# EAGLE design das_updated_v7 (EAGLE 7.7.0)
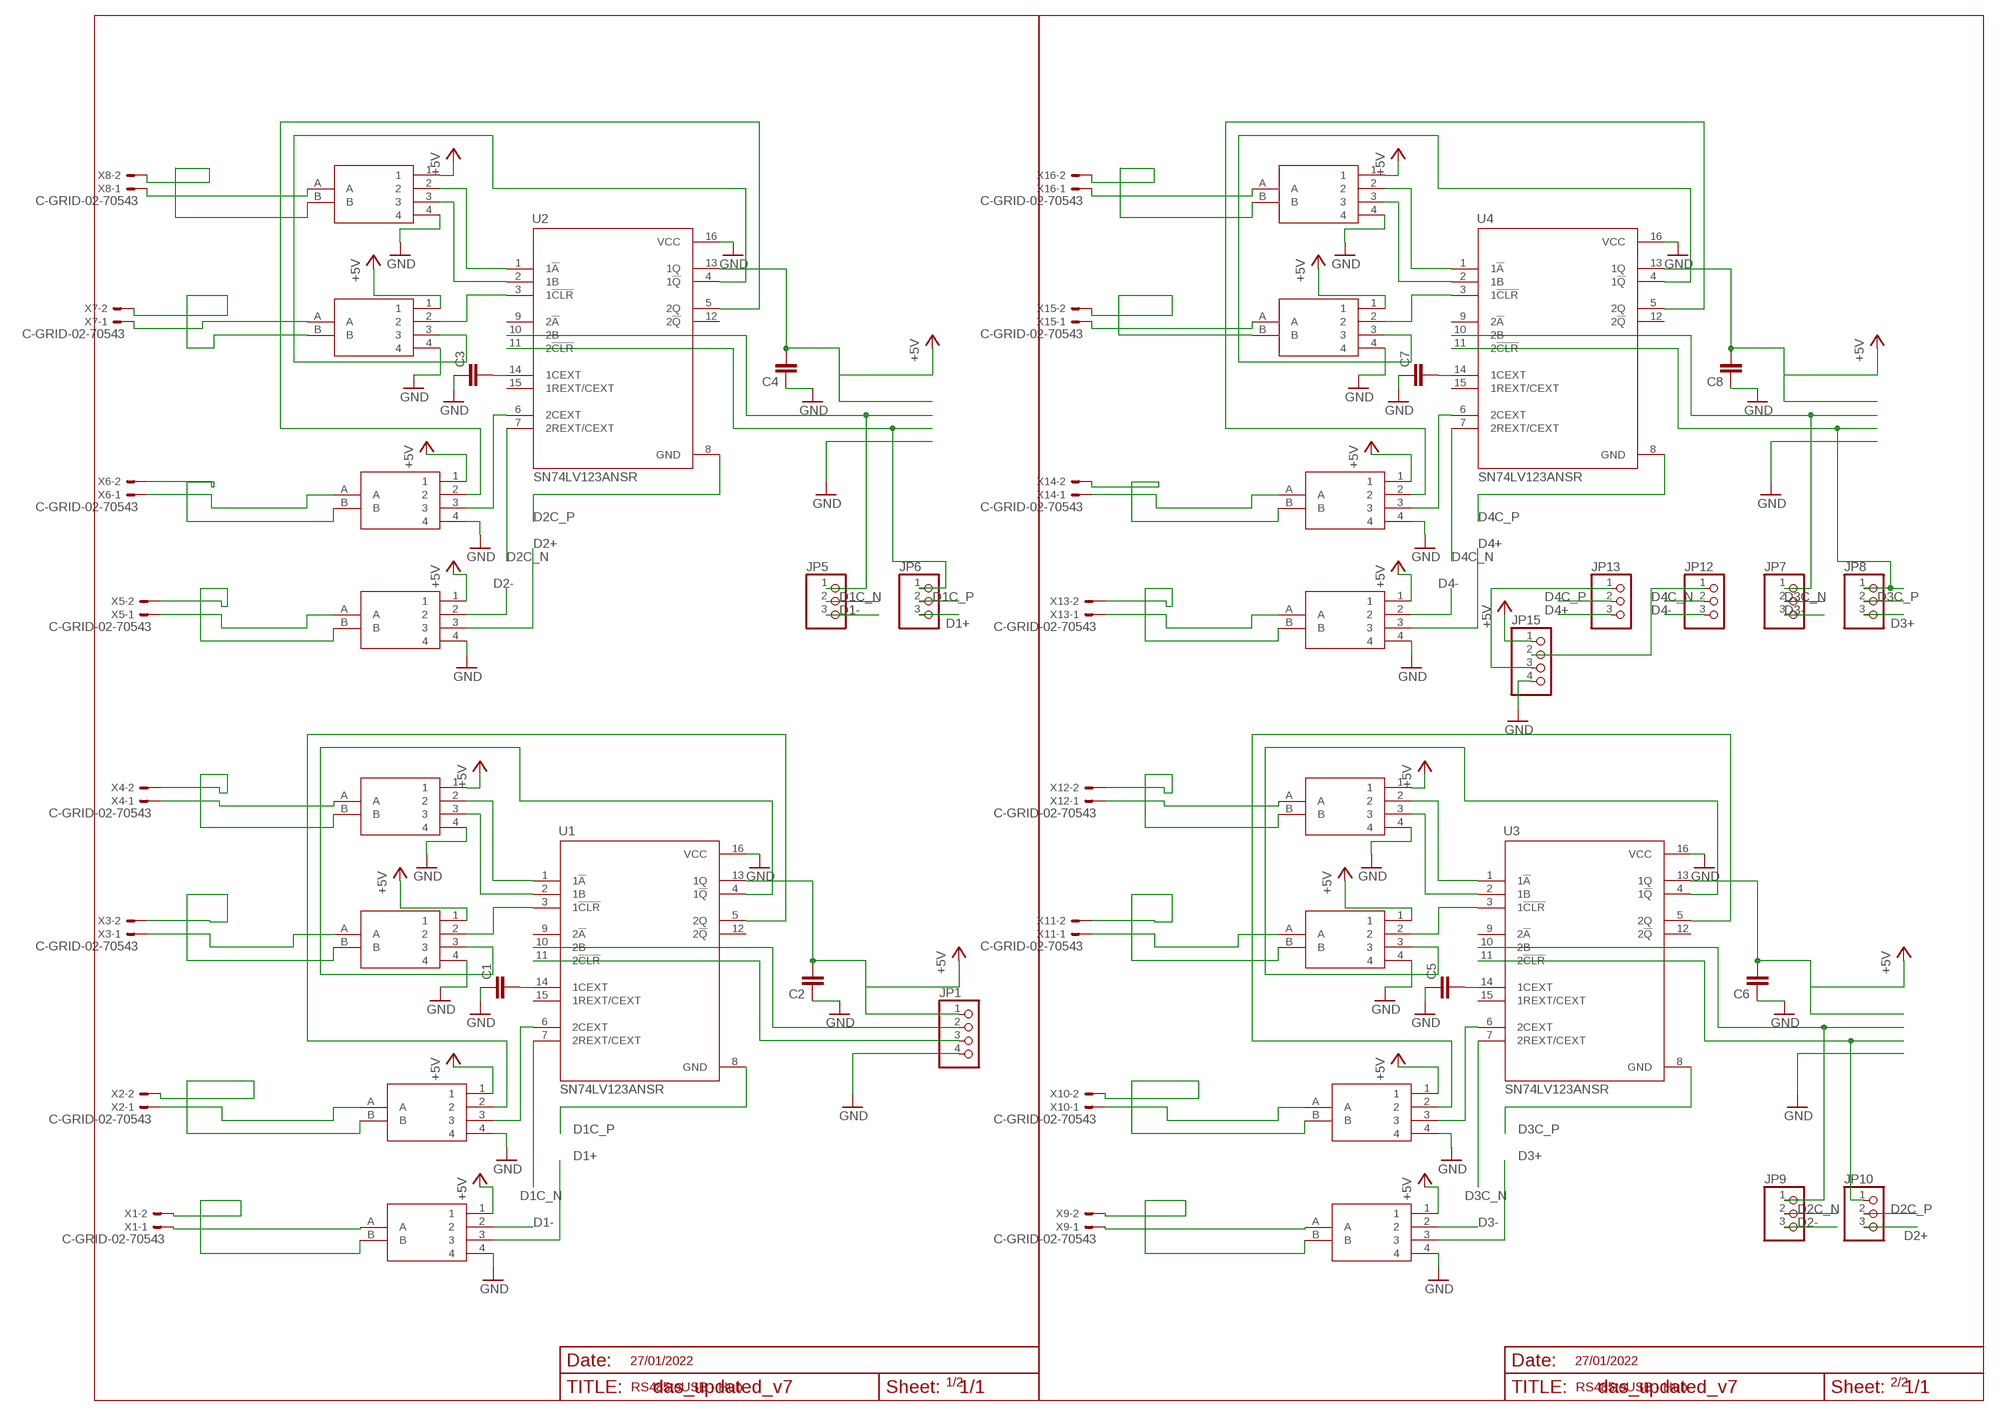
[diagram p0: schematic, sheet 1]

## Parts
C1  C-EUC0603K  [C0603K]
C2  C-EUC0603K  [C0603K]
C3  C-EUC0603K  [C0603K]
C4  C-EUC0603K  [C0603K]
C5  C-EUC0603K  [C0603K]
C6  C-EUC0603K  [C0603K]
C7  C-EUC0603K  [C0603K]
C8  C-EUC0603K  [C0603K]
JP1  PINHD-1X4  [1X04]
JP5  PINHD-1X3  [1X03]
JP6  PINHD-1X3  [1X03]
JP7  PINHD-1X3  [1X03]
JP8  PINHD-1X3  [1X03]
JP9  PINHD-1X3  [1X03]
JP10  PINHD-1X3  [1X03]
JP12  PINHD-1X3  [1X03]
JP13  PINHD-1X3  [1X03]
JP15  PINHD-1X4  [1X04]
U1  SN74LV123ANSR  [SOIC127P780X200-16N]
U2  SN74LV123ANSR  [SOIC127P780X200-16N]
U3  SN74LV123ANSR  [SOIC127P780X200-16N]
U4  SN74LV123ANSR  [SOIC127P780X200-16N]
USB2RS1  USB2RS485  [USB2RS485]
USB2RS2  USB2RS485  [USB2RS485]
USB2RS3  USB2RS485  [USB2RS485]
USB2RS4  USB2RS485  [USB2RS485]
USB2RS5  USB2RS485  [USB2RS485]
USB2RS6  USB2RS485  [USB2RS485]
USB2RS7  USB2RS485  [USB2RS485]
USB2RS8  USB2RS485  [USB2RS485]
USB2RS9  USB2RS485  [USB2RS485]
USB2RS10  USB2RS485  [USB2RS485]
USB2RS11  USB2RS485  [USB2RS485]
USB2RS12  USB2RS485  [USB2RS485]
USB2RS13  USB2RS485  [USB2RS485]
USB2RS14  USB2RS485  [USB2RS485]
USB2RS15  USB2RS485  [USB2RS485]
USB2RS16  USB2RS485  [USB2RS485]
X1  C-GRID-02-70543  [70543-02]
X2  C-GRID-02-70543  [70543-02]
X3  C-GRID-02-70543  [70543-02]
X4  C-GRID-02-70543  [70543-02]
X5  C-GRID-02-70543  [70543-02]
X6  C-GRID-02-70543  [70543-02]
X7  C-GRID-02-70543  [70543-02]
X8  C-GRID-02-70543  [70543-02]
X9  C-GRID-02-70543  [70543-02]
X10  C-GRID-02-70543  [70543-02]
X11  C-GRID-02-70543  [70543-02]
X12  C-GRID-02-70543  [70543-02]
X13  C-GRID-02-70543  [70543-02]
X14  C-GRID-02-70543  [70543-02]
X15  C-GRID-02-70543  [70543-02]
X16  C-GRID-02-70543  [70543-02]

## Nets
+5V: C2.2 C4.2 C6.2 C8.2 JP1.1 JP15.1 U1.13(1Q) U2.13(1Q) U3.13(1Q) U4.13(1Q) USB2RS1.1 USB2RS2.1 USB2RS3.1 USB2RS4.1 USB2RS5.1 USB2RS6.1 USB2RS7.1 USB2RS8.1 USB2RS9.1 USB2RS10.1 USB2RS11.1 USB2RS12.1 USB2RS13.1 USB2RS14.1 USB2RS15.1 USB2RS16.1
D1+ [data]: JP6.3 USB2RS4.3
D1- [data]: JP5.3 USB2RS4.2
D1C_N [data]: JP5.2 U1.7(2REXT/CEXT)
D1C_P [data]: JP6.2 U1.8(GND)
D2+ [data]: JP10.3 USB2RS8.3
D2- [data]: JP9.3 USB2RS8.2
D2C_N [data]: JP9.2 U2.7(2REXT/CEXT)
D2C_P [data]: JP10.2 U2.8(GND)
D3+ [data]: JP8.3 USB2RS12.3
D3- [data]: JP7.3 USB2RS12.2
D3C_N [data]: JP7.2 U3.7(2REXT/CEXT)
D3C_P [data]: JP8.2 U3.8(GND)
D4+ [data]: JP13.3 USB2RS16.3
D4- [data]: JP12.3 USB2RS16.2
D4C_N [data]: JP12.2 U4.7(2REXT/CEXT)
D4C_P [data]: JP13.2 U4.8(GND)
D_N [data]: JP1.3 U1.11(2!CLR)
D_P [data]: JP1.2 U1.10(2B)
GND: C1.1 C2.1 C3.1 C4.1 C5.1 C6.1 C7.1 C8.1 JP1.4 JP15.4 U1.16(VCC) U2.16(VCC) U3.16(VCC) U4.16(VCC) USB2RS1.4 USB2RS2.4 USB2RS3.4 USB2RS4.4 USB2RS5.4 USB2RS6.4 USB2RS7.4 USB2RS8.4 USB2RS9.4 USB2RS10.4 USB2RS11.4 USB2RS12.4 USB2RS13.4 USB2RS14.4 USB2RS15.4 USB2RS16.4
MOD2_N [data]: U1.6(2CEXT) USB2RS3.3
MOD2_P [data]: U1.5(2Q) USB2RS3.2
MOD3_N [data]: U1.4(1!Q) USB2RS2.3
MOD3_P [data]: U1.3(1!CLR) USB2RS2.2
MOD4_N [data]: U1.2(1B) USB2RS1.3
MOD4_P [data]: U1.1(1!A) USB2RS1.2
MOD7_N [data]: U2.6(2CEXT) USB2RS7.3
MOD7_P [data]: U2.5(2Q) USB2RS7.2
MOD8_N [data]: U2.4(1!Q) USB2RS6.3
MOD8_P [data]: U2.3(1!CLR) USB2RS6.2
MOD9_N [data]: U2.2(1B) USB2RS5.3
MOD9_P [data]: U2.1(1!A) USB2RS5.2
MOD10_N [data]: U3.6(2CEXT) USB2RS11.3
MOD10_P [data]: U3.5(2Q) USB2RS11.2
MOD11_N [data]: U3.4(1!Q) USB2RS10.3
MOD11_P [data]: U3.3(1!CLR) USB2RS10.2
MOD12_N [data]: U3.2(1B) USB2RS9.3
MOD12_P [data]: U3.1(1!A) USB2RS9.2
MOD14_N [data]: U4.6(2CEXT) USB2RS15.3
MOD14_P [data]: U4.5(2Q) USB2RS15.2
MOD15_N [data]: U4.4(1!Q) USB2RS14.3
MOD15_P [data]: U4.3(1!CLR) USB2RS14.2
MOD16_N [data]: U4.2(1B) USB2RS13.3
MOD16_P [data]: U4.1(1!A) USB2RS13.2
N$3: JP6.1 U2.11(2!CLR)
N$7: C1.2 U1.14(1CEXT)
N$17: C3.2 U2.14(1CEXT)
N$21: JP5.1 U2.10(2B)
N$31: JP12.1 JP15.2
N$32: JP13.1 JP15.3
N$42: C5.2 U3.14(1CEXT)
N$58: C7.2 U4.14(1CEXT)
N$59: JP7.1 U4.10(2B)
N$78: JP8.1 U4.11(2!CLR)
N$79: JP9.1 U3.10(2B)
N$80: JP10.1 U3.11(2!CLR)
X1_N [data]: USB2RS4.B X1.2
X1_P [data]: USB2RS4.A X1.1
X2_N [data]: USB2RS3.B X2.2
X2_P [data]: USB2RS3.A X2.1
X3_N [data]: USB2RS2.B X3.2
X3_P [data]: USB2RS2.A X3.1
X4_N [data]: USB2RS1.B X4.2
X4_P [data]: USB2RS1.A X4.1
X5_N [data]: USB2RS8.B X5.2
X5_P [data]: USB2RS8.A X5.1
X6_N [data]: USB2RS7.B X6.2
X6_P [data]: USB2RS7.A X6.1
X7_N [data]: USB2RS6.B X7.2
X7_P [data]: USB2RS6.A X7.1
X8_N [data]: USB2RS5.B X8.2
X8_P [data]: USB2RS5.A X8.1
X9_N [data]: USB2RS12.B X9.2
X9_P [data]: USB2RS12.A X9.1
X10_N [data]: USB2RS11.B X10.2
X10_P [data]: USB2RS11.A X10.1
X11_N [data]: USB2RS10.B X11.2
X11_P [data]: USB2RS10.A X11.1
X12_N [data]: USB2RS9.B X12.2
X12_P [data]: USB2RS9.A X12.1
X13_N [data]: USB2RS16.B X13.2
X13_P [data]: USB2RS16.A X13.1
X14_N [data]: USB2RS15.B X14.2
X14_P [data]: USB2RS15.A X14.1
X15_N [data]: USB2RS14.B X15.2
X15_P [data]: USB2RS14.A X15.1
X16_N [data]: USB2RS13.B X16.2
X16_P [data]: USB2RS13.A X16.1
Unconnected: U1.9(2!A) U1.12(2!Q) U1.15(1REXT/CEXT) U2.9(2!A) U2.12(2!Q) U2.15(1REXT/CEXT) U3.9(2!A) U3.12(2!Q) U3.15(1REXT/CEXT) U4.9(2!A) U4.12(2!Q) U4.15(1REXT/CEXT)

## Notes on the sheet
- 27/01/2022 | 27/01/2022
- 1/2 | 2/2
- RS485toUSB - Hub | RS485toUSB - Hub

## Library data of the parts
C1-C8 = resistor:C-EU: CAPACITOR, European symbol
JP1 JP15 = pinhead:PINHD-1X4: PIN HEADER
JP5-JP10 JP12 JP13 = pinhead:PINHD-1X3: PIN HEADER
U1-U4 = SN74LV123ANSR:SN74LV123ANSR: Monostable Multivibrator 13ns 16-SO Check prices <https://pricing.snapeda.com/parts/SN74LV123ANSR/Texas%20Instruments/view-part?ref=eda>; AVAILABILITY: In Stock; DESCRIPTION: Dual Retriggerable Monostable Multivibrators 16-SO -40 to 125; MF: Texas Instruments; MP: SN74LV123ANSR; PACKAGE: SOP-16 Texas Instruments; PRICE: None; PURCHASE-URL: https://pricing.snapeda.com/search/part/SN74LV123ANSR/?ref=eda
USB2RS1-USB2RS16 = USB2RS485:USB2RS485
X1-X16 = con-molex:C-GRID-02: CONNECTOR wire to board 2.54 mm (0.100") pitch header; MF: MOLEX; OC_FARNELL: unknown; OC_NEWARK: unknown

## Net classes
0 default: clearance 0.305 mm
1 data: width 0.127 mm, clearance 0.305 mm

## Board
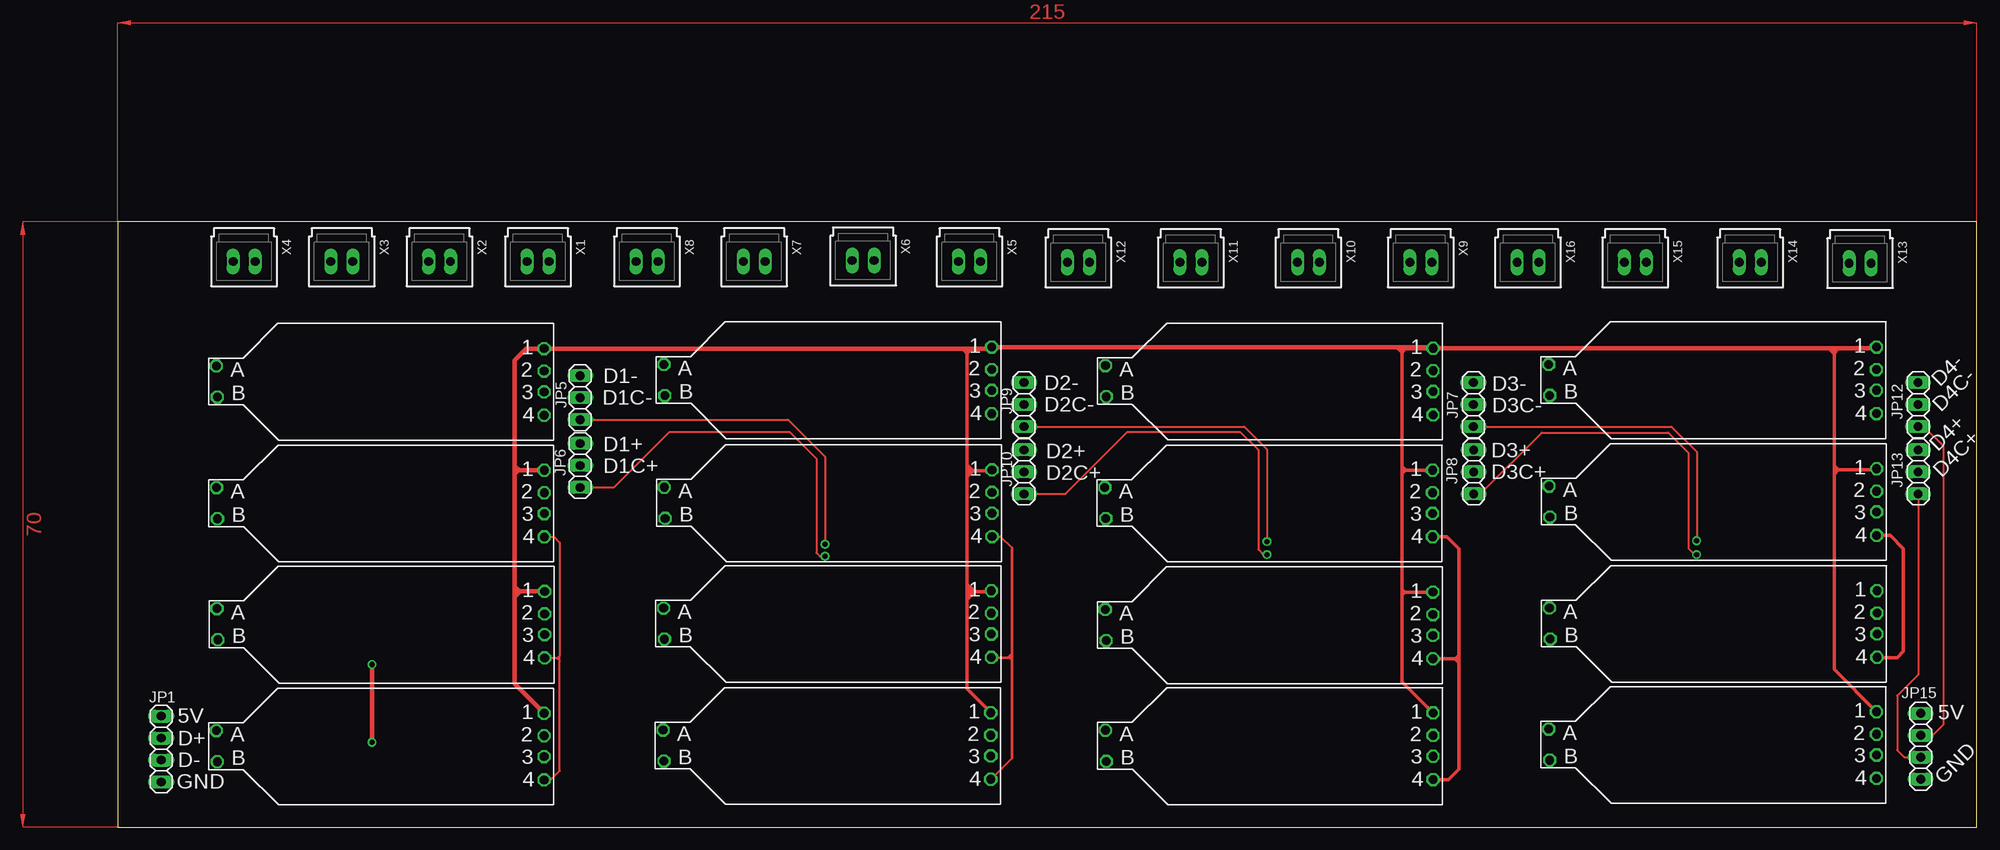
[diagram p1: board, top side]
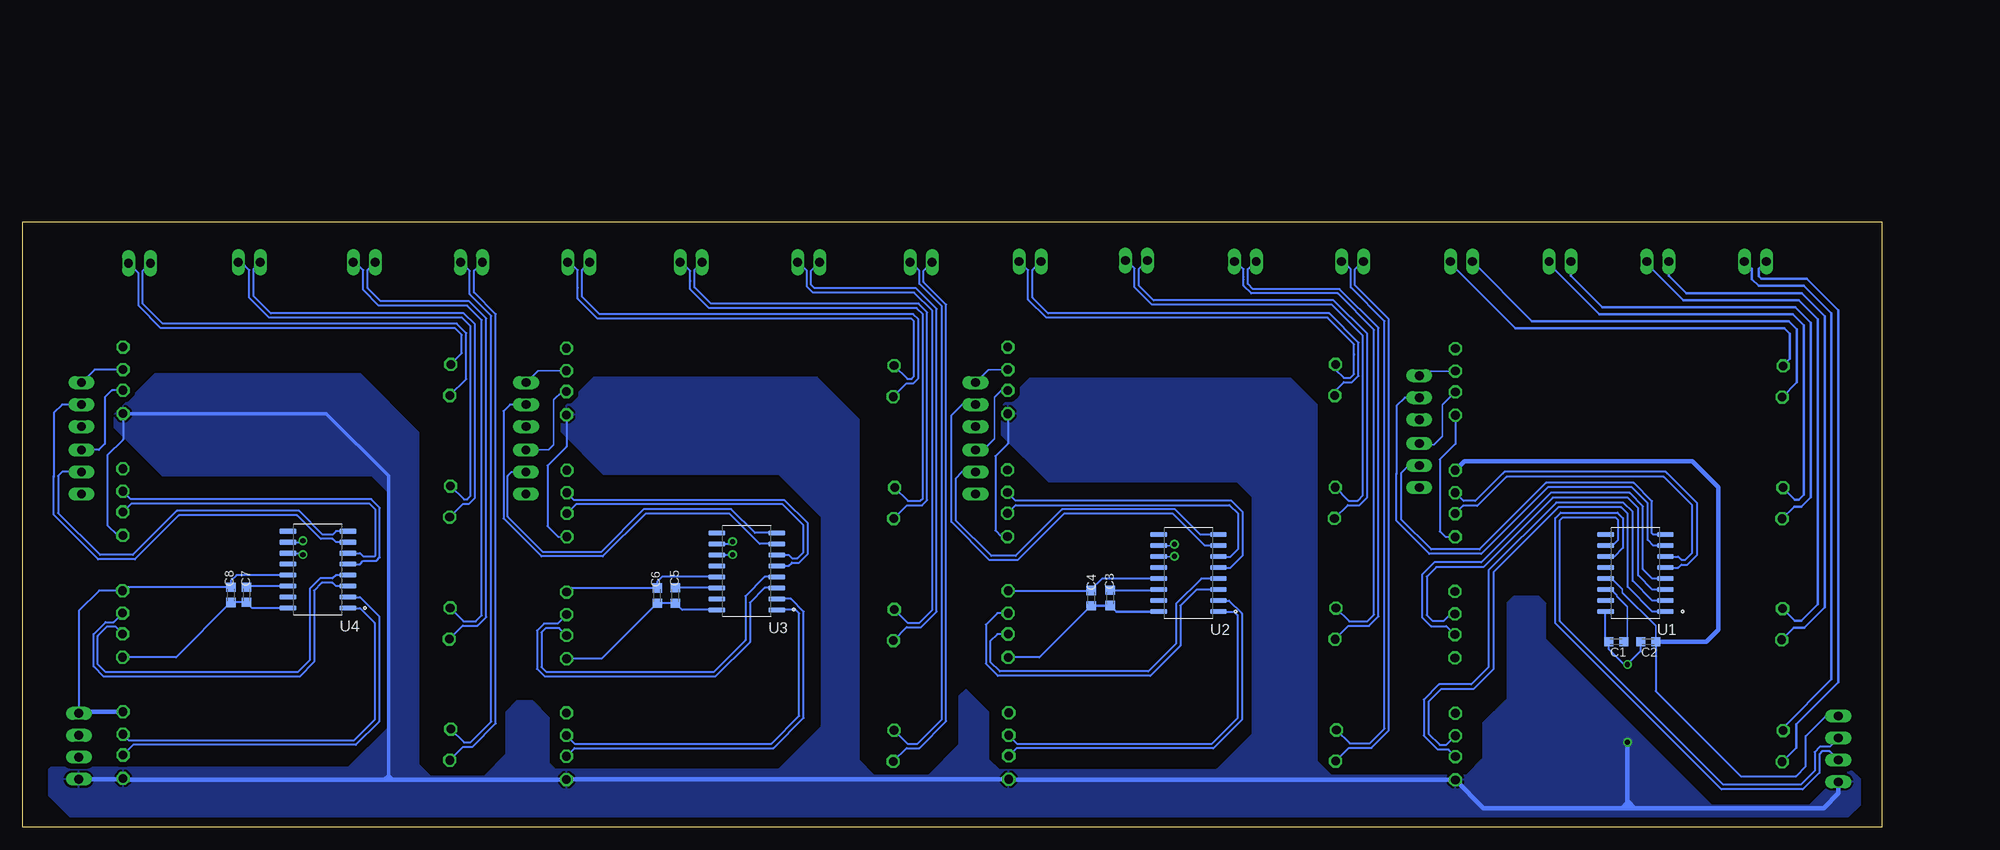
[diagram p2: board, bottom side, seen from below]

Size 215 x 70 mm. Coordinates in mm from the lower left corner, seen from the top.
Outline: 0,0 215,0 215,70 0,70 0,0
Copper layers (1*16): Top 0.035mm / dielectric 1.5mm / Bottom 0.035mm
Design rules "default": minimum track width 6mil, minimum drill 0.35mm, track to track 6mil, track to pad 6mil, pad to pad 6mil, via to via 6mil, smd to smd 6mil, copper to edge 40mil, drill to drill 6mil, minimum pad ring 10mil, minimum via ring 8mil, stop-mask expansion 4mil, vias tented up to drill 0mil, thermal gap 10mil

### Footprints (pad centres in the part's own frame; a part is rotated, then mirrored left to right if it is on the bottom)
C0603K = smd 1.05 x 1.08: 1 -0.875,0; 2 0.875,0
1X04 = drill 1.016 long: 1 -3.81,0; 2 -1.27,0; 3 1.27,0; 4 3.81,0
1X03 = drill 1.016 long: 1 -2.54,0; 2 0,0; 3 2.54,0
SOIC127P780X200-16N = smd 1.97 x 0.61: 1 -3.465,4.445; 2 -3.465,3.175; 3 -3.465,1.905; 4 -3.465,0.635; 5 -3.465,-0.635; 6 -3.465,-1.905; 7 -3.465,-3.175; 8 -3.465,-4.445; 9 3.465,-4.445; 10 3.465,-3.175; 11 3.465,-1.905; 12 3.465,-0.635; 13 3.465,0.635; 14 3.465,1.905; 15 3.465,3.175; 16 3.465,4.445
USB2RS485 = drill 1 pad 1.422 octagon: 1 36.9,3.6; 2 36.9,1; 3 36.9,-1.4; 4 36.9,-4.1; A -1,1.6; B -0.9,-2
70543-02 = drill 1.016 long: 1 -1.27,0; 2 1.27,0

### Placement (x,y rotation side)
C1  30.69,21.42 0 bottom
C2  27,21.42 0 bottom
C3  89.22,26.49 90 bottom
C4  91.42,26.48 90 bottom
C5  139.52,26.77 90 bottom
C6  141.62,26.76 90 bottom
C7  189.12,26.85 90 bottom
C8  190.92,26.84 90 bottom
JP1  5.02,9.02 270 top
JP5  53.48,49.65 90 top
JP6  53.48,41.81 90 top
JP7  156.78,48.85 90 top
JP8  156.81,41.06 90 top
JP9  104.81,48.85 90 top
JP10  104.81,41.06 90 top
JP12  208.21,48.85 90 top
JP13  208.21,41.06 90 top
JP15  208.51,9.34 270 top
U1  28.48,29.36 180 bottom
U2  80.17,29.36 180 bottom
U3  131.26,29.56 180 bottom
U4  180.85,29.76 180 bottom
USB2RS1  12.4,9.55 0 top
USB2RS2  12.46,23.65 0 top
USB2RS3  12.42,37.65 0 top
USB2RS4  12.4,51.72 0 top
USB2RS5  64.06,9.62 0 top
USB2RS6  64.12,23.72 0 top
USB2RS7  64.2,37.69 0 top
USB2RS8  64.16,51.89 0 top
USB2RS9  115.22,9.59 0 top
USB2RS10  115.2,23.56 0 top
USB2RS11  115.16,37.66 0 top
USB2RS12  115.22,51.76 0 top
USB2RS13  166.5,9.73 0 top
USB2RS14  166.56,23.73 0 top
USB2RS15  166.52,37.83 0 top
USB2RS16  166.5,51.9 0 top
X1  48.6,65.4 180 top
X2  37.2,65.4 180 top
X3  25.9,65.4 180 top
X4  14.6,65.4 180 top
X5  98.5,65.4 180 top
X6  86.2,65.5 180 top
X7  73.6,65.4 180 top
X8  61.2,65.4 180 top
X9  150.7,65.3 180 top
X10  137.7,65.3 180 top
X11  124.1,65.3 180 top
X12  111.1,65.3 180 top
X13  201.5,65.2 180 top
X14  188.8,65.3 180 top
X15  175.5,65.3 180 top
X16  163.1,65.3 180 top

### Tracks (layer width: path | path; a pad name or v marks a point on that pad's centre or on a via)
+5V
  Top 0.254: 201.4,55.36 201.4,55.06 201.3,55.06 | USB2RS3.1 46.62,41.25 45.9,41.97 | 45.9,41.97 45.9,54 46,54.1 | 45.9,41.1 45.9,41.97 | 148.5,55.3 148.5,55.49
  Top 0.406: 98.2,55.32 98.2,54.8 | 98.2,54.8 98.2,41.9 | 98.2,41.9 98.9,41.2 | 98.9,41.2 101.01,41.2 USB2RS7.1 | 98.2,41.9 98.2,41.2 | 98.2,41.2 98.2,40.6 | 98.2,40.6 98.2,28.1 | 98.2,28.1 98.65,27.65 | 98.65,27.65 99.1,27.2 | 99.1,27.2 100.9,27.2 USB2RS6.1 | USB2RS5.1 98.2,15.98 98.2,26.3 | 98.2,26.3 98.2,27.2 | 98.2,27.2 98.2,28.1 | 99.1,27.2 98.65,26.75 | 98.65,26.75 98.2,26.3 | 99.1,27.2 98.2,27.2 | 98.65,27.65 98.2,27.2 | 98.2,27.2 98.65,26.75 | 98.9,41.2 98.3,40.6 98.2,40.6 | 98.9,41.2 98.2,41.2 | 98.2,54.8 97.68,55.32 97.6,55.32 | 98.2,54.8 98.7,55.3 98.7,55.32 | 46.4,41.25 45.9,40.75 45.9,40.3 | 45.9,27.9 46.55,27.25 46.65,27.25 | 45.9,26.5 46.65,27.25 | 46.65,27.25 46.7,27.25 | USB2RS11.1 148.9,41.26 | 148.9,41.26 148.74,41.26 148.5,41.5 | 148.5,41.5 148.5,41.7 | 148.5,41.7 148.5,54.86 | 148.5,54.89 148.5,55.3 | USB2RS10.1 148.84,27.16 | 148.84,27.16 148.5,27.5 | 148.5,27.5 148.5,40.86 | 148.5,40.86 148.5,41.5 | 148.5,40.86 148.9,41.26 | 148.9,41.26 148.9,41.3 148.5,41.7 | USB2RS9.1 148.5,16.81 148.5,26.82 | 148.5,26.82 148.5,27.5 | 148.5,26.82 148.84,27.16 | 148.5,54.86 148.5,54.89 | 148.5,54.89 147.9,55.49 | 148.5,54.86 149,55.36 | USB2RS13.1 198.5,18.23 198.5,40.8 | 198.5,40.8 198.5,41.3 | 198.5,41.3 198.5,41.8 | 198.5,41.8 198.5,54.8 | 198.5,55.36 198.5,54.8 | 198.5,54.8 199.06,55.36 199.1,55.36 | 198.5,54.8 198.46,54.8 197.9,55.36 | USB2RS15.1 203.29,41.3 199,41.3 | 199,41.3 198.5,41.3 | 199,41.3 198.5,41.8 | 199,41.3 198.5,40.8
  Top 0.508: 46,54.1 47.2,55.3 49.28,55.3 USB2RS4.1 97.6,55.32 98.2,55.32 98.7,55.32 100.89,55.32 USB2RS8.1 147.9,55.49 152.27,55.49 152.4,55.36 | USB2RS1.1 45.9,16.55 45.9,26.5 45.9,27.1 | 45.9,27.1 45.9,27.9 45.9,40.3 45.9,41.1 | 45.9,41.1 45.9,54 | USB2RS3.1 46.4,41.25 46.05,41.25 45.9,41.1 | USB2RS2.1 46.7,27.25 46.05,27.25 45.9,27.1 | USB2RS16.1 203.26,55.36 201.4,55.36 199.1,55.36 198.5,55.36 197.9,55.36 152.4,55.36 | 152.4,55.36 USB2RS12.1 149,55.36 148.56,55.36 148.5,55.3
  Bottom 0.2: U1.13 31.23,28.73 29.98,27.48 29.98,27.11 26.14,23.27 26.14,21.43 C2.2
  Bottom 0.254: 134.01,28.94 U3.13 141.07,28.92 141.62,28.38 C6.2 151.62,27.63 USB2RS10.1 | 184.29,29.1 U4.13 190.28,29.12 190.92,28.48 C8.2 203.07,27.72 USB2RS14.1 206.17,27.33 208.5,25 JP15.1 | USB2RS6.1 101,27.3 91.47,27.3 C4.2 91.48,27.42 90.17,28.73 U2.13 | C2.2 26.12,15.73 16.3,5.9 9.9,5.9 8.8,7 8.8,10.5 6.47,12.83 JP1.1
  Bottom 0.508: JP15.1 208.33,13.33 USB2RS13.1 | USB2RS3.1 48.27,42.3 21.9,42.3 18.9,39.3 18.9,22.8 20.27,21.43 26.14,21.43
D1+
  Bottom 0.2: USB2RS4.3 50.8,48.82 50.8,45.2 51.8,44.2 53.33,44.2 JP6.3
D1-
  Bottom 0.2: USB2RS4.2 52.95,52.72 JP5.3
D1C_N
  Bottom 0.203: U1.7 26.41,32.53 27.07,33.2 27.07,37.47 28.9,39.3 38.6,39.3 46.31,31.59 52.31,31.59 56.11,35.39 56.11,40.8 56.11,40.9 56.11,48.69 55.15,49.65 JP5.2
D1C_P
  Bottom 0.203: U1.8 26.41,33.8 26.56,33.96 26.56,37.68 28.69,39.81 38.81,39.81 46.52,32.1 52.1,32.1 55.6,35.6 55.6,40.9 54.69,41.81 JP6.2
D2+
  Bottom 0.2: JP10.3 103.9,43.6 102.6,44.9 102.6,49.7 101.81,50.49 USB2RS8.3
D2-
  Bottom 0.2: USB2RS8.2 103.31,52.89 JP9.3
D2C_N
  Bottom 0.203: U2.7 78.25,32.53 81.94,36.22 94.58,36.22 99.95,30.85 103.17,30.85 107.61,35.29 107.61,47.59 106.35,48.85 JP9.2
D2C_P
  Bottom 0.203: U2.8 78.81,33.8 81.73,36.73 94.79,36.73 100.16,31.36 102.96,31.36 107.1,35.5 107.1,40.3 106.34,41.06 JP10.2
D3+
  Bottom 0.2: USB2RS12.3 152.62,50.36 153.6,49.38 153.6,44.2 154.2,43.6 JP8.3
D3-
  Bottom 0.2: USB2RS12.2 155.41,52.76 JP7.3
D3C_N
  Bottom 0.203: U3.7 129.75,32.73 133.26,36.24 142.96,36.24 147.91,31.29 155.01,31.29 159.41,35.69 159.41,48.09 158.65,48.85 JP7.2
D3C_P
  Bottom 0.203: U3.8 130.31,34 133.05,36.75 143.17,36.75 148.12,31.8 154.8,31.8 158.9,35.9 158.9,40.6 158.44,41.06 JP8.2
D4+
  Bottom 0.254: USB2RS16.3 204.7,50.5 205.5,49.7 205.5,44.3 206.2,43.6 JP13.3
D4-
  Bottom 0.254: USB2RS16.2 206.7,52.9 JP12.3
D4C_N
  Bottom 0.203: U4.7 178.78,32.94 179.16,33.32 180.53,33.32 183.26,36.04 196.96,36.04 202.05,30.95 206.27,30.95 211.41,36.09 211.41,40.5 211.41,40.6 211.41,47.89 210.45,48.85 JP12.2
D4C_P
  Bottom 0.203: U4.8 178.78,34.2 179.16,33.82 180.32,33.82 183.05,36.55 197.17,36.55 202.26,31.46 206.06,31.46 210.9,36.3 210.9,40.6 210.44,41.06 JP13.2
D_N
  Bottom 0.254: JP1.3 6.01,8.74 6.9,8.74 7.2,8.44 7.2,6.27 9.13,4.34 18.53,4.34 37.76,23.57 37.76,35.73 37.13,36.36 30.57,36.36 29.92,35.71 29.92,32.28 30.93,31.27 U1.11
D_P
  Bottom 0.254: JP1.2 6.01,9.3 7.13,9.3 7.76,8.67 7.76,6.5 9.36,4.9 18.3,4.9 37.2,23.8 37.2,35.5 36.9,35.8 30.8,35.8 30.48,35.48 30.48,33.22 31.16,32.53 U1.10
GND  (via drill 0.6)
  Top 0.254: USB2RS3.4 50.45,33.55 51.1,32.9 51.1,19.8 | 51.1,19.8 50.8,19.5 | 50.8,19.5 49.41,19.5 USB2RS2.4 | USB2RS1.4 50.05,5.45 51.1,6.5 51.1,19.2 | 51.1,19.2 51.1,19.8 | 50.8,19.5 51.1,19.2
  Top 0.305: USB2RS7.4 102.11,33.59 103.4,32.3 103.4,20.1 | 103.4,20.1 102.9,19.6 | 102.9,19.6 101.04,19.6 USB2RS6.4 | USB2RS5.4 103.4,7.96 103.4,19.3 | 103.4,19.3 103.4,19.7 | 103.4,19.7 103.4,20.1 | 103.4,19.3 103.1,19.6 | 103.1,19.6 102.9,19.6 | 103.4,19.7 103.2,19.7 103.1,19.6
  Top 0.406: USB2RS11.4 153.74,33.56 155.1,32.2 155.1,19.86 | 155.1,19.86 155.1,19.5 | 155.1,19.5 155.1,19 | 155.1,19 155.1,6.7 153.89,5.49 USB2RS9.4 | USB2RS10.4 154.7,19.46 | 154.7,19.46 155.06,19.46 155.1,19.5 | 154.7,19.46 155.1,19.86 | 154.7,19.46 154.7,19.4 155.1,19 | USB2RS15.4 204.97,33.73 206.5,32.2 206.5,20.3 205.8,19.6 203.49,19.6 USB2RS14.4
  Top 0.508: v29.4,18.8 v29.4,9.8
  Bottom 0.254: 134.85,24.98 U3.16 138.74,25.12 C5.1 141.61,25.9 C6.1 | C6.1 141.6,25.91 | C7.1 189.13,25.97 | C3.1 89.2,25.59 | 152.08,47.7 USB2RS12.4 152.12,43.98 154.3,41.8 154.3,34.8 153.06,33.56 USB2RS11.4 | U4.16 188.46,25.31 C7.1 | C7.1 C8.1 197.25,19.63 USB2RS14.4 | USB2RS4.4 49.3,44.3 51.1,42.5 51.1,34.2 50.45,33.55 USB2RS3.4 | U1.16 31.95,21.8 C1.1 31.57,20.56 29.8,18.8 v29.4,18.8 27.9,20.3 27.9,21.4 C2.1 | C6.1 148.04,19.46 USB2RS10.4 | C4.1 91.56,25.46 97.41,19.62 USB2RS6.4 | USB2RS16.4 203.4,47.3 203.4,44.8 205.2,43 205.2,34.9 204.03,33.73 USB2RS15.4 | USB2RS8.4 101.06,44.34 102.5,42.9 102.5,34.3 101.79,33.59 USB2RS7.4
  Bottom 0.305: U2.16 88.52,24.91 C3.1 91.41,25.62 91.56,25.46
  Bottom 0.406: 172.7,5.49 172.7,6 | 172.7,6 172.7,40.6 179.9,47.8 202.9,47.8 203.4,47.3 | 172.2,5.49 172.2,5.5 172.7,6 | 172.7,6 173.2,5.5 173.2,5.49
  Bottom 0.508: JP1.4 5.02,3.88 6.7,2.2 28.6,2.2 | 28.6,2.2 29.3,2.2 | 29.3,2.2 30,2.2 | 30,2.2 46.05,2.2 USB2RS1.4 100.89,5.45 USB2RS5.4 152.09,5.52 USB2RS9.4 172.2,5.49 172.7,5.49 173.2,5.49 203.26,5.49 USB2RS13.4 203.5,5.53 JP15.4 | v29.4,9.8 29.4,2.8 | 29.3,2.2 29.3,2.9 | 29.3,2.9 28.6,2.2 | 29.3,2.9 29.4,2.8 | 29.4,2.8 30,2.2
  pour Bottom (isolate 0.61): 3.5,6.5 2.5,5.5 2.5,2.6 3.9,1.2 209.5,1.2 212,3.7 212,6.6 211.7,6.9 177.3,6.9 172.7,11.5 172.7,38.7 174.6,40.6 198.8,40.6 204.4,46.2 204.4,47.7 199.7,52.4 176,52.4 169.2,45.6 169.2,7.2 167.9,5.9 161.6,5.9 159.1,8.4 159.1,13.3 157.8,14.6 156.1,14.6 154.1,12.6 154.1,7.3 153.5,6.7 127.5,6.7 122.6,11.6 122.6,35.9 127.5,40.8 147.8,40.8 152.7,45.7 152.7,48.2 148.9,52 123.2,52 118.3,47.1 118.3,7.7 116.6,6 110.2,6 106.7,9.5 106.7,15.1 105.9,15.9 103.3,13.3 103.3,7.8 102.1,6.6 76.9,6.6 72.8,10.7 72.8,38.2 74.5,39.9 96.3,39.9 101.9,45.5 101.9,48.5 98.5,51.9 68.4,51.9 65.3,48.8 65.3,7.6 63.7,6 48,6 46.1,7.9 46.1,12 43.3,14.8 43.3,25.9 42.5,26.7 39.7,26.7 38.9,25.9 38.9,21.7 19.7,2.5 8.3,2.5 4.3,6.5
MOD2_N
  Bottom 0.254: U1.6 23.52,31.27 23.17,30.91 22.7,30.91 21.9,31.71 21.9,37.2 25.2,40.5 43.4,40.5 46.76,37.14 48.43,37.14 USB2RS3.3
MOD2_P
  Bottom 0.254: U1.5 23.52,29.99 23.17,30.35 22.47,30.35 21.34,31.48 21.34,37.43 24.8,40.89 | 24.8,40.89 | 24.8,40.89 24.97,41.06 43.63,41.06 43.8,40.89 | 43.8,40.89 | 43.8,40.89 46.99,37.7 48.37,37.7 USB2RS3.2
MOD3_N
  Bottom 0.254: U1.4 26.51,28.73 27.6,29.82 27.6,37.09 29.15,38.64 38.27,38.64 46.31,30.6 51.73,30.6 53.16,29.17 53.16,24.27 52.13,23.24 50.35,23.24 USB2RS2.3
MOD3_P
  Bottom 0.254: U1.3 26.51,27.45 28.16,29.11 28.16,36.86 29.38,38.08 38.04,38.08 46.08,30.04 51.5,30.04 52.6,28.94 52.6,24.5 51.9,23.8 50.7,23.8 49.85,24.65 USB2RS2.2
MOD4_N
  Bottom 0.254: U1.2 26.51,26.19 28.8,28.48 28.8,36.43 29.89,37.52 37.63,37.52 45.46,29.7 45.46,18.5 47.46,16.5 51.19,16.5 52.96,14.73 52.96,10.57 51.33,8.94 50.09,8.94 USB2RS1.3
MOD4_P
  Bottom 0.254: U1.1 26.51,24.91 29.36,27.77 29.36,36.2 30.12,36.97 37.4,36.97 44.9,29.47 44.9,18.27 47.23,15.94 50.96,15.94 52.4,14.5 52.4,10.8 51.1,9.5 50.35,9.5 USB2RS1.2
MOD7_N
  Bottom 0.203: U2.6 75.31,31.27 74.4,32.18 74.4,36.2 75.44,37.24 100.15,37.24 USB2RS7.3
MOD7_P
  Bottom 0.203: U2.5 75.31,29.99 73.89,31.42 73.89,34.8 73.89,35 73.89,36.41 75.23,37.74 100.15,37.74 USB2RS7.2
MOD8_N
  Bottom 0.203: U2.4 78.69,28.73 81.61,25.81 81.61,21.2 84.81,18 102,18 103.1,19.1 103.1,21.5 102.28,22.32 USB2RS6.3
MOD8_P
  Bottom 0.203: U2.3 79.25,27.45 81.1,25.6 81.1,20.99 84.6,17.49 102.21,17.49 103.61,18.89 103.61,23.39 102.28,24.72 USB2RS6.2
MOD9_N
  Bottom 0.203: U2.2 75.47,26.19 73.99,24.71 73.99,12.39 77.29,9.09 100.09,9.09 USB2RS5.3
MOD9_P
  Bottom 0.203: U2.1 74.92,24.91 74.5,24.5 74.5,12.6 77.5,9.6 99.94,9.6 USB2RS5.2
MOD10_N
  Bottom 0.203: U3.6 126.4,31.47 126.02,31.08 125.4,31.08 124.7,31.78 124.7,34.9 127.1,37.3 151.02,37.3 USB2RS11.3
MOD10_P
  Bottom 0.203: U3.5 126.4,30.2 126.02,30.58 125.19,30.58 124.19,31.57 124.19,35.11 126.89,37.81 151.21,37.81 USB2RS11.2
  Bottom 0.254: U3.5
MOD11_N
  Bottom 0.203: U3.4 129.19,28.92 131.41,26.7 131.41,21.6 135.11,17.9 154.4,17.9 155,18.5 155,22.5 154.5,23 152.94,23 USB2RS10.3
MOD11_P
  Bottom 0.203: U3.3 129.19,27.66 130.9,25.94 130.9,21.39 134.9,17.39 154.61,17.39 155.51,18.29 155.51,22.71 154.71,23.51 153.15,23.51 USB2RS10.2
MOD12_N
  Bottom 0.203: USB2RS9.3 151.17,9.14 128.19,9.14 124.69,12.63 124.69,24.91 126.17,26.38 U3.2
MOD12_P
  Bottom 0.203: USB2RS9.2 151.17,9.64 128.4,9.64 125.2,12.84 125.2,24.7 125.61,25.12 U3.1
MOD14_N
  Bottom 0.203: U4.6 175.99,31.67 175.61,31.28 174.3,31.28 174.2,31.38 174.2,36.7 174.9,37.4 202.45,37.4 USB2RS15.3
MOD14_P
  Bottom 0.203: U4.5 175.99,30.4 175.61,30.78 174.09,30.78 173.69,31.17 173.69,36.91 174.69,37.91 202.5,37.91 USB2RS15.2
MOD15_N
  Bottom 0.203: U4.4 178.78,29.12 179.16,28.74 180.61,28.74 181.81,27.55 181.81,19.3 183.21,17.9 205.4,17.9 206.3,18.8 206.3,22.1 205.2,23.2 205.1,23.2 204.33,23.2 USB2RS14.3
MOD15_P
  Bottom 0.203: U4.3 178.78,27.85 179.16,28.24 180.4,28.24 181.3,27.34 181.3,19.09 183,17.39 205.61,17.39 206.81,18.59 206.81,22.31 205.41,23.71 204.48,23.71 USB2RS14.2
MOD16_N
  Bottom 0.203: U4.2 175.99,26.59 173.79,24.38 173.79,12.19 176.49,9.49 202.24,9.49 USB2RS13.3
MOD16_P
  Bottom 0.203: U4.1 175.99,25.31 174.3,23.62 174.3,12.4 176.7,10 202.67,10 USB2RS13.2
N$3  (via drill 0.6)
  Top 0.254: JP6.1 57.37,39.27 63.8,45.7 77.7,45.7 80.8,42.6 80.8,31.7 81.2,31.3 v81.8,31.3
  Bottom 0.152: U2.11 81.83,31.27 v81.8,31.3
N$7
  Bottom 0.2: U1.14 31.25,27.45 30.6,26.8 30.6,26.7 29.4,25.5 29.4,21.84 C1.2
N$17
  Bottom 0.254: 83.78,27.6 U2.14 83.72,27.37 C3.2
N$21  (via drill 0.6)
  Top 0.254: JP5.1 77.49,47.11 81.8,42.8 v81.8,32.7
  Bottom 0.152: U2.10 81.97,32.53 v81.8,32.7
N$31
  Top 0.254: JP12.1 208.89,46.31 211.1,44.1 211.1,11.8 209.8,10.5 208.62,10.5 JP15.2
N$32
  Top 0.254: JP13.1 208.21,17.61 205.8,15.2 205.8,8.9 206.63,8.07 JP15.3
N$42
  Bottom 0.254: U3.14 C5.2
N$58
  Bottom 0.254: 189.3,27.91 C7.2 188.99,27.85 U4.14
N$59  (via drill 0.6)
  Top 0.254: JP7.1 179.69,46.31 182.6,43.4 v182.6,33.1
  Bottom 0.254: U4.10 182.76,32.94 v182.6,33.1
N$78  (via drill 0.6)
  Top 0.254: JP8.1 157.61,38.52 164.69,45.6 179.3,45.6 181.64,43.26 181.64,32.23 182.37,31.5 v182.6,31.5
  Bottom 0.254: U4.11 182.76,31.66 v182.6,31.5
N$79  (via drill 0.6)
  Top 0.254: v132.9,33 132.9,43.7 130.29,46.31 JP9.1
  Bottom 0.254: U3.10 133.16,32.73 v132.9,33
N$80  (via drill 0.6)
  Top 0.254: JP10.1 109.62,38.52 116.8,45.7 129.8,45.7 131.9,43.6 131.9,32.1 132.5,31.5 v132.9,31.5
  Bottom 0.254: U3.11 132.94,31.47 v132.9,31.5
X1_N
  Bottom 0.3: X1.2 40.43,58.5 10.73,58.5 9.8,57.57 9.8,51.42 USB2RS4.B
X1_P
  Bottom 0.3: X1.1 49.87,65.18 42.39,57.7 11.26,57.7 10.6,57.04 10.6,54.12 USB2RS4.A
X2_N
  Bottom 0.3: X2.2 35.93,63.73 32.3,60.1 9.97,60.1 8.2,58.33 8.2,38.12 9.27,37.05 10.12,37.05 USB2RS3.B
X2_P
  Bottom 0.3: X2.1 38.47,65.14 32.63,59.3 10.3,59.3 9,58 9,38.45 9.6,37.85 10.02,37.85 USB2RS3.A
X3_N
  Bottom 0.3: X3.2 24.63,63.73 22.6,61.7 9.23,61.7 6.6,59.07 6.6,25.42 8.97,23.05 10.16,23.05 USB2RS2.B
X3_P
  Bottom 0.3: X3.1 27.17,65.14 22.93,60.9 9.56,60.9 7.4,58.74 7.4,25.75 9.3,23.85 10.06,23.85 USB2RS2.A
X4_N
  Bottom 0.3: X4.2 14.2,64.53 14.2,63.7 13.9,63.4 8.67,63.4 5,59.73 5,16.77 9.9,11.87 9.9,9.15 USB2RS1.B
X4_P
  Bottom 0.3: X4.1 15,64.53 15,63.37 14.23,62.6 9,62.6 5.8,59.4 5.8,17.1 11.4,11.5 USB2RS1.A
X5_N
  Bottom 0.203: USB2RS8.B 63.26,50.38 62.2,51.44 61.25,51.44 60.51,52.17 60.51,56.03 63.89,59.41 96.4,59.41 98.2,61.21 98.2,64.43 X5.2
X5_P
  Bottom 0.203: USB2RS8.A 63.16,52.9 62.2,51.94 61.46,51.94 61.02,52.38 61.02,54.6 61.02,54.7 61.02,55.82 64.1,58.9 96.61,58.9 98.71,61 98.71,64.41 99.7,65.4 X5.1
X6_N
  Bottom 0.203: USB2RS7.B 61.75,37.24 60.39,37.24 59.49,38.13 59.49,57.01 63.39,60.91 84.21,60.91 85.9,62.6 85.9,64.53 X6.2
X6_P
  Bottom 0.203: USB2RS7.A 61.65,37.74 60.6,37.74 60,38.34 60,56.8 63.6,60.4 84.42,60.4 86.41,62.39 86.41,64.6 87.31,65.5 X6.1
X7_N
  Bottom 0.203: USB2RS6.B 61.67,23.27 59.29,23.27 58.19,24.36 58.19,57.71 62.69,62.21 72.71,62.21 73.3,62.8 73.3,64.5 72.4,65.4 X7.2
X7_P
  Bottom 0.203: USB2RS6.A 61.57,23.77 59.5,23.77 58.7,24.57 58.7,57.5 62.9,61.7 72.92,61.7 73.81,62.59 73.81,63.3 73.81,63.6 73.81,64.5 74.71,65.4 X7.1
X8_N
  Bottom 0.203: USB2RS5.B 61.61,9.17 58.99,9.17 56.99,11.16 56.99,58.71 60.9,62.62 60.9,64.5 60,65.4 X8.2
X8_P
  Bottom 0.203: USB2RS5.A 61.51,9.67 59.2,9.67 57.5,11.37 57.5,58.5 61.41,62.41 61.41,64.5 62.31,65.4 X8.1
X9_N
  Bottom 0.203: USB2RS12.B 112.77,51.31 111.99,51.31 111.41,51.89 111.41,58.71 112.01,59.31 148.3,59.31 150.3,61.31 150.3,64.43 X9.2
X9_P
  Bottom 0.203: USB2RS12.A 112.67,51.81 112.2,51.81 111.92,52.1 111.92,58.5 112.22,58.8 148.51,58.8 150.81,61.1 150.81,62.3 150.81,62.4 150.81,64.41 151.7,65.3 X9.1
X10_N
  Bottom 0.203: USB2RS11.B 112.71,37.21 110.99,37.21 110.39,37.8 110.39,59.51 111.39,60.51 135.41,60.51 137.3,62.4 137.3,64.43 X10.2
X10_P
  Bottom 0.203: USB2RS11.A 112.61,37.71 111.2,37.71 110.9,38.01 110.9,59.3 111.6,60 135.62,60 137.81,62.19 137.81,63.1 137.81,63.2 137.81,64.3 138.81,65.3 X10.1
X11_N
  Bottom 0.203: USB2RS10.B 112.75,23.11 111.09,23.11 109.29,24.9 109.29,59.91 111.69,62.31 123.41,62.31 123.8,62.7 123.8,64.33 X11.2
X11_P
  Bottom 0.203: USB2RS10.A 112.65,23.61 111.3,23.61 109.8,25.11 109.8,59.7 111.9,61.8 123.62,61.8 124.31,62.49 124.31,64.31 125.3,65.3 X11.1
X12_N
  Bottom 0.203: USB2RS9.B 112.77,9.14 111.29,9.14 108.19,12.23 108.19,60.41 110.8,63.02 110.8,64.33 X12.2
X12_P
  Bottom 0.203: USB2RS9.A 112.67,9.64 111.5,9.64 108.7,12.44 108.7,60.2 111.31,62.81 111.31,63.6 111.31,63.7 111.31,64.31 112.3,65.3 X12.1
X13_N
  Bottom 0.203: USB2RS16.B 163.71,51.79 163.71,57.11 164.81,58.21 198.81,58.21 201.1,60.5 201.1,64.33 X13.2
X13_P
  Bottom 0.203: USB2RS16.A 164.22,54.78 164.22,56.9 165.02,57.7 199.02,57.7 201.61,60.29 201.61,64.04 X13.1
X14_N
  Bottom 0.203: USB2RS15.B 164.07,37.38 163.39,37.38 162.69,38.07 162.69,58.11 163.99,59.41 186.31,59.41 188.3,61.4 188.3,64.53 X14.2
X14_P
  Bottom 0.203: USB2RS15.A 163.97,37.88 163.6,37.88 163.2,38.28 163.2,57.9 164.2,58.9 186.52,58.9 188.81,61.19 188.81,64.41 189.7,65.3 X14.1
X15_N
  Bottom 0.203: USB2RS14.B 164.11,23.28 162.39,23.28 161.39,24.27 161.39,58.81 163.39,60.81 173.6,60.81 175.1,62.31 175.1,64.43 X15.2
X15_P
  Bottom 0.203: USB2RS14.A 164.01,23.78 162.6,23.78 161.9,24.48 161.9,58.6 163.6,60.3 173.81,60.3 175.61,62.1 175.61,64.4 176.51,65.3 X15.1
X16_N
  Bottom 0.203: USB2RS13.B 164.05,9.28 162.99,9.28 160.29,11.97 160.29,59.31 162.8,61.82 162.8,64.33 X16.2
X16_P
  Bottom 0.203: USB2RS13.A 163.95,9.78 163.2,9.78 160.8,12.18 160.8,59.1 163.31,61.61 163.31,64.31 164.3,65.3 X16.1
(copper drawn outside any net)
  shapes: Top area x2

### Text on the board
tNames: D1- | D4- | D2- | D3- | D1C- | D2C- | D3C- | D4C- | D4C+ | D1+ | D2+ | D3+ | D4+ | D1C+ | D2C+ | D3C+ | 5V | 5V | D+ | D- | GND | GND